# Altium schematic sheet StepCounter_LCD.SchDoc
size A
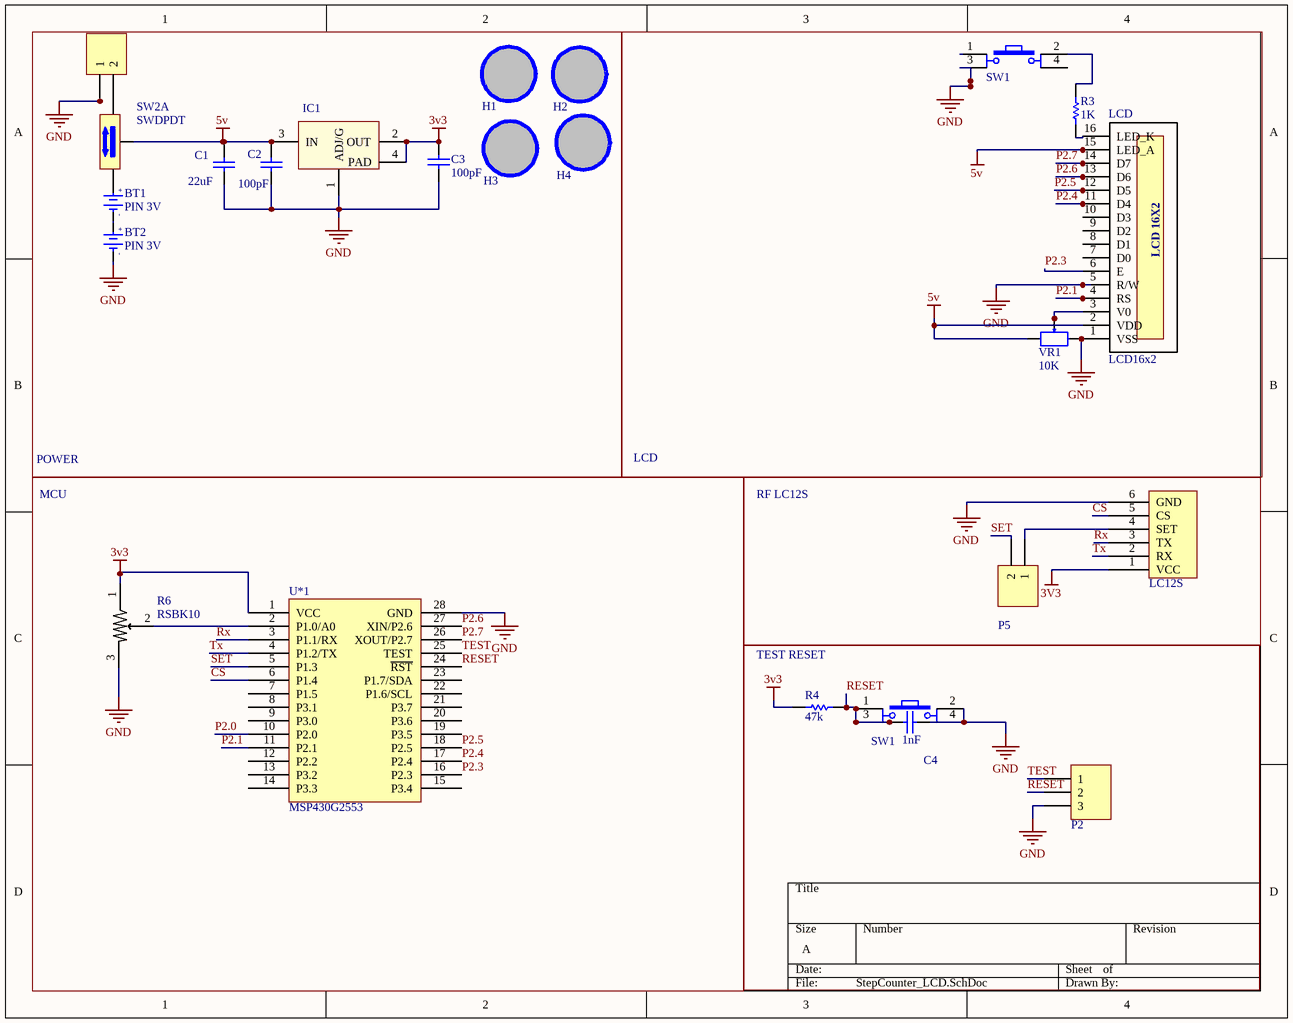
[diagram p0: StepCounter_LCD.SchDoc]

## Parts
(Parts that share a designator on the sheet are numbered #1, #2 ... from top to bottom, then left to right.)
?  Header 2  [JP2]  (value not drawn)
BT1  PIN 3V  [PIN3V]
BT2  PIN 3V  [PIN3V]
C1  value 22uF  [CAP-SM-0805]  (hidden comment: Cap Non-Pol SMD)
C2  value 100pF  [CAP-SM-0805]  (hidden comment: Cap Non-Pol SMD)
C3  value 100pF  [CAP-SM-0805]  (hidden comment: Cap Non-Pol SMD)
C4  value 1nF  [CAP-SM-0805]  (hidden comment: Cap Non-Pol SMD)
H1  Hole  [LO KHOAN 3MM]  (value not drawn)
H2  Hole  [LO KHOAN 3MM]  (value not drawn)
H3  Hole  [LO KHOAN 3MM]  (value not drawn)
H4  Hole  [LO KHOAN 3MM]  (value not drawn)
IC1  LM1117  [SOT223-4N]  (value not drawn)
LCD  LCD16x2  [LCD_16x2]
P2  Header 3  [JP3]  (value not drawn)
P5  Header 2  [JP2]  (value not drawn)
R3  value 1K  [RES-SM-0805]  (hidden comment: RESISTOR SMD)
R4  value 47k  [RES-SM-0805]  (hidden comment: RESISTOR SMD)
R6  RSBK10  [REBK10]
RF*1  LC12S  [JP6]
SW1#1  SW  [Tact SW 4 pin]  (value not drawn)
SW1#2  SW  [Tact SW 4 pin]  (value not drawn)
SW2  SWDPDT  [SWDPDT_1.5x1]  (part A of 2)
U*1  MSP430G2553  [msp430g2553tsstop]
VR1  10K  [VR]

## Blocks framed on the sheet
POWER: ? BT1 BT2 C1-C3 H1-H4 IC1 SW2
LCD: LCD R3 SW1#1 VR1
MCU: R6 U*1
RF LC12S: P5 RF*1
TEST RESET: C4 P2 R4 SW1#2

## Nets
3v3: C3.2 IC1.2(OUT) IC1.4(PAD) R4.1 R6.1 RF*1.1(VCC) U*1.1(VCC)
5v: C1.2 C2.2 IC1.3(IN) LCD.2(VDD) LCD.15(LED_A) SW2.2 VR1.1
GND: ?.1 BT2.2(GND) C1.1 C2.1 C3.1 C4.2 IC1.1(ADJ/G) LCD.1(VSS) LCD.5(R/W) P2.3 R6.3 RF*1.6(GND) SW1#1.3 SW1#2.2 SW1#2.4 U*1.28(GND) VR1.3
CS: RF*1.5(CS) U*1.6(P1.4)
P2.0: U*1.10(P2.0)
P2.1: LCD.4(RS) U*1.11(P2.1)
P2.3: LCD.6(E) U*1.16(P2.3)
P2.4: LCD.11(D4) U*1.17(P2.4)
P2.5: LCD.12(D5) U*1.18(P2.5)
P2.6: LCD.13(D6) U*1.27(XIN/P2.6)
P2.7: LCD.14(D7) U*1.26(XOUT/P2.7)
RESET: C4.1 P2.2 R4.2 SW1#2.1 SW1#2.3 U*1.24(~{RST})
Rx: RF*1.3(TX) U*1.3(P1.1/RX)
SET: P5.2 U*1.5(P1.3)
TEST: P2.1 U*1.25(TEST)
Tx: RF*1.2(RX) U*1.4(P1.2/TX)
Net?_2: ?.2 SW2.3
NetBT1_1: BT1.1(+3V) SW2.1
NetBT1_2: BT1.2(GND) BT2.1(+3V)
NetLCD_3: LCD.3(V0) VR1.2
NetLCD_16: LCD.16(LED_K) R3.1
NetP5_1: P5.1 RF*1.4(SET)
NetR3_2: R3.2 SW1#1.2
NetR6_2: R6.2 U*1.2(P1.0/A0)

Not connected (* = marked no-connect by the designer): H1 1; H2 1; H3 1; H4 1; LCD 7(D0) 8(D1) 9(D2) 10(D3); SW1#1 1 4; U*1 7(P1.5) 8(P3.1) 9(P3.0) 12(P2.2) 13(P3.2) 14(P3.3) 15(P3.4) 19(P3.5) 20(P3.6) 21(P3.7) 22(P1.6/SCL) 23(P1.7/SDA)

## Notes on the sheet
- (in symbol LCD16x2) LCD 16X2
- (in symbol PIN 3V) +; -

## Library data of the parts
? P5 = Header 2: Header, 2-Pin; LatestRevisionDate: 17-Jul-2002; LatestRevisionNote: Re-released for DXP Platform.; Publisher: Altium Limited
BT1 BT2 = PIN 3V: Battery 3VDC; Value: PIN 3V
C1-C4 = Cap Non-Pol SMD: Capacitor
H1-H4 = Hole: Hole 3mm
IC1 = LM1117: Available in 1.8V, 2.5V, 2.85V, 3.3V, 5V, and  Adjustable Versions; Value: LM317
P2 = Header 3: Header, 3-Pin; LatestRevisionDate: 17-Jul-2002; LatestRevisionNote: Re-released for DXP Platform.; Publisher: Altium Limited
R3 R4 = RESISTOR SMD: Resistor
SW1#1 SW1#2 = Tact SW - 4Pin: Switch button 4 pin; Value: Button chip 4 pin
SW2 = SWDPDT: Switch SPDT; Creat by: VanDungEvn@Gmail.com
VR1 = VR: Var Resistor; Value: VR 10K